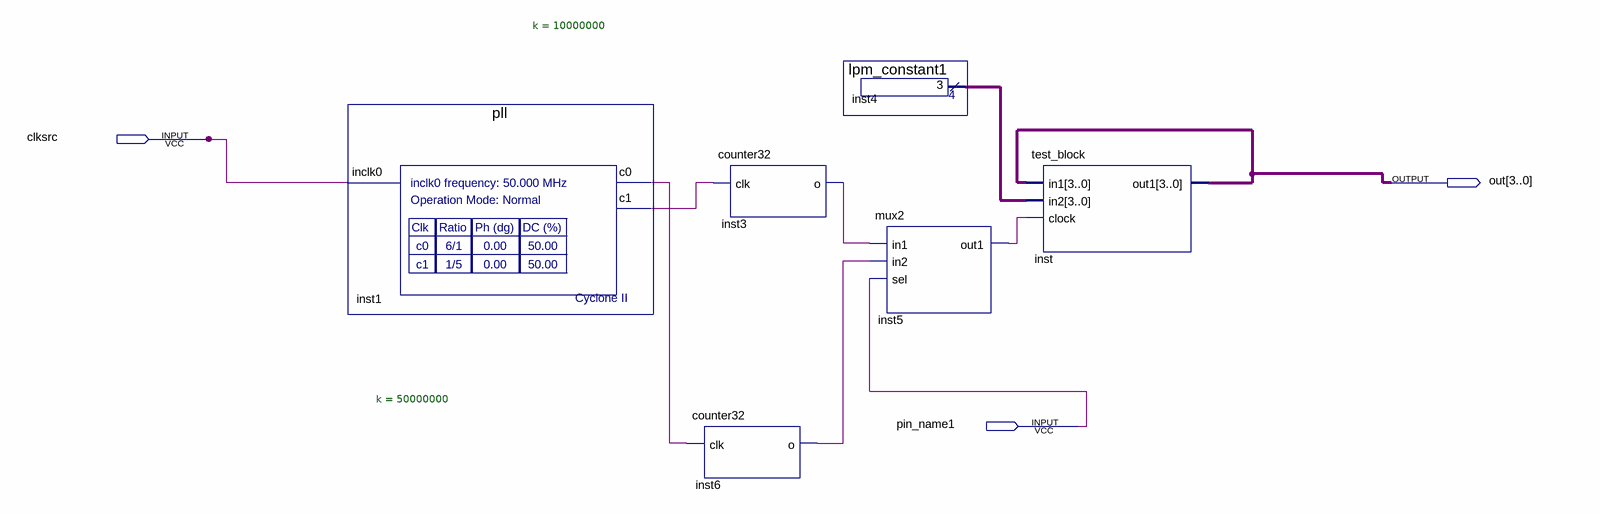
[diagram p0: schematic sheet]
// Quartus schematic test.bdf as structural Verilog: 6 symbols, 3 pins
module test (
  input  clksrc,
  input  pin_name1,
  output [3:0] out
);

  wire inst1_c0, inst1_c1, inst3_o, inst5_out1, inst6_o;
  wire [3:0] inst4_result;

  pll inst1 (.inclk0(clksrc), .c0(inst1_c0), .c1(inst1_c1));
  counter32 #(.k(10000000)) inst3 (.clk(inst1_c1), .o(inst3_o));
  counter32 #(.k(50000000)) inst6 (.clk(inst1_c0), .o(inst6_o));
  lpm_constant1 inst4 (.result(inst4_result));
  mux2 inst5 (.in1(inst3_o), .in2(inst6_o), .sel(pin_name1), .out1(inst5_out1));
  test_block inst (.in1(out), .in2(inst4_result), .clock(inst5_out1), .out1(out));
endmodule
